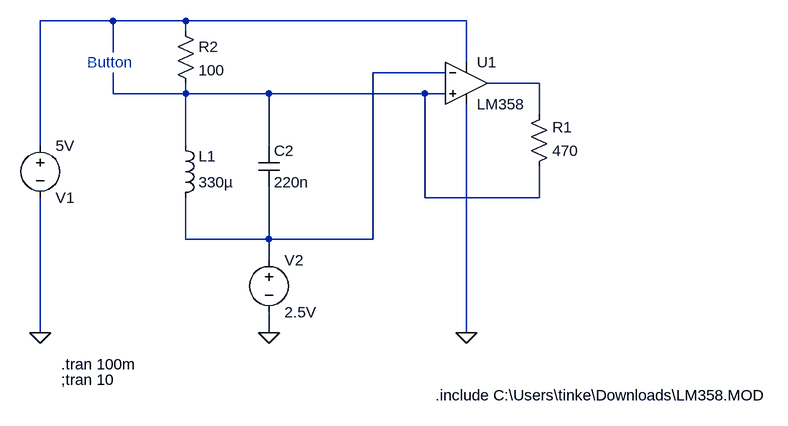
[diagram p0: schematic minedetector.asc]
minedetector.asc, the LTspice schematic file:
Version 4
SHEET 1 1720 680
WIRE -368 32 -480 32
WIRE -256 32 -368 32
WIRE 176 32 -256 32
WIRE -256 48 -256 32
WIRE -368 80 -368 32
WIRE 176 96 176 32
WIRE 144 112 32 112
WIRE 288 128 208 128
WIRE -368 144 -368 112
WIRE -256 144 -256 128
WIRE -256 144 -368 144
WIRE -128 144 -256 144
WIRE 112 144 -128 144
WIRE 144 144 112 144
WIRE 288 176 288 128
WIRE -480 224 -480 32
WIRE -256 224 -256 144
WIRE -128 224 -128 144
WIRE 112 304 112 144
WIRE 288 304 288 256
WIRE 288 304 112 304
WIRE -256 368 -256 304
WIRE -128 368 -128 288
WIRE -128 368 -256 368
WIRE 32 368 32 112
WIRE 32 368 -128 368
WIRE -128 400 -128 368
WIRE -480 512 -480 304
WIRE -128 512 -128 480
WIRE 176 512 176 160
FLAG -480 512 0
FLAG -128 512 0
FLAG 176 512 0
SYMBOL OpAmps\\opamp2 176 64 R0
SYMATTR InstName U1
SYMATTR Value LM358
SYMATTR SpiceModel LM358
SYMBOL cap -144 224 R0
SYMATTR InstName C2
SYMATTR Value 220n
SYMBOL ind -272 320 M180
WINDOW 0 36 80 Left 2
WINDOW 3 36 40 Left 2
SYMATTR InstName L1
SYMATTR Value 330µ
SYMBOL res 272 272 M180
WINDOW 0 36 76 Left 2
WINDOW 3 36 40 Left 2
SYMATTR InstName R1
SYMATTR Value 470
SYMBOL voltage -480 208 R0
WINDOW 0 24 96 Left 2
WINDOW 3 24 16 Left 2
WINDOW 123 0 0 Left 0
WINDOW 39 0 0 Left 0
SYMATTR InstName V1
SYMATTR Value 5V
SYMBOL voltage -128 384 R0
WINDOW 123 0 0 Left 0
WINDOW 39 0 0 Left 0
SYMATTR InstName V2
SYMATTR Value 2.5V
SYMBOL res -272 32 R0
SYMATTR InstName R2
SYMATTR Value 100
TEXT 128 608 Left 2 !.include C:\\Users\\tinke\\Downloads\\LM358.MOD
TEXT -448 560 Left 2 !.tran 100m
TEXT -448 584 Left 2 !;tran 10
TEXT -408 96 Left 2 ;Button

The netlist it stands for:
* minedetector.asc
XU1 N004 N002 N001 0 N003 LM358 LM358  ; pins In+ In- V+ V- OUT
C2 N004 N002 220n
L1 N002 N004 330µ
R1 N004 N003 470
V1 N001 0 5V
V2 N002 0 2.5V
R2 N001 N004 100
.include C:\Users\tinke\Downloads\LM358.MOD
.tran 100m
;tran 10
* Button
.backanno
.end